# EAGLE schematic control project (EAGLE 9.6.2)
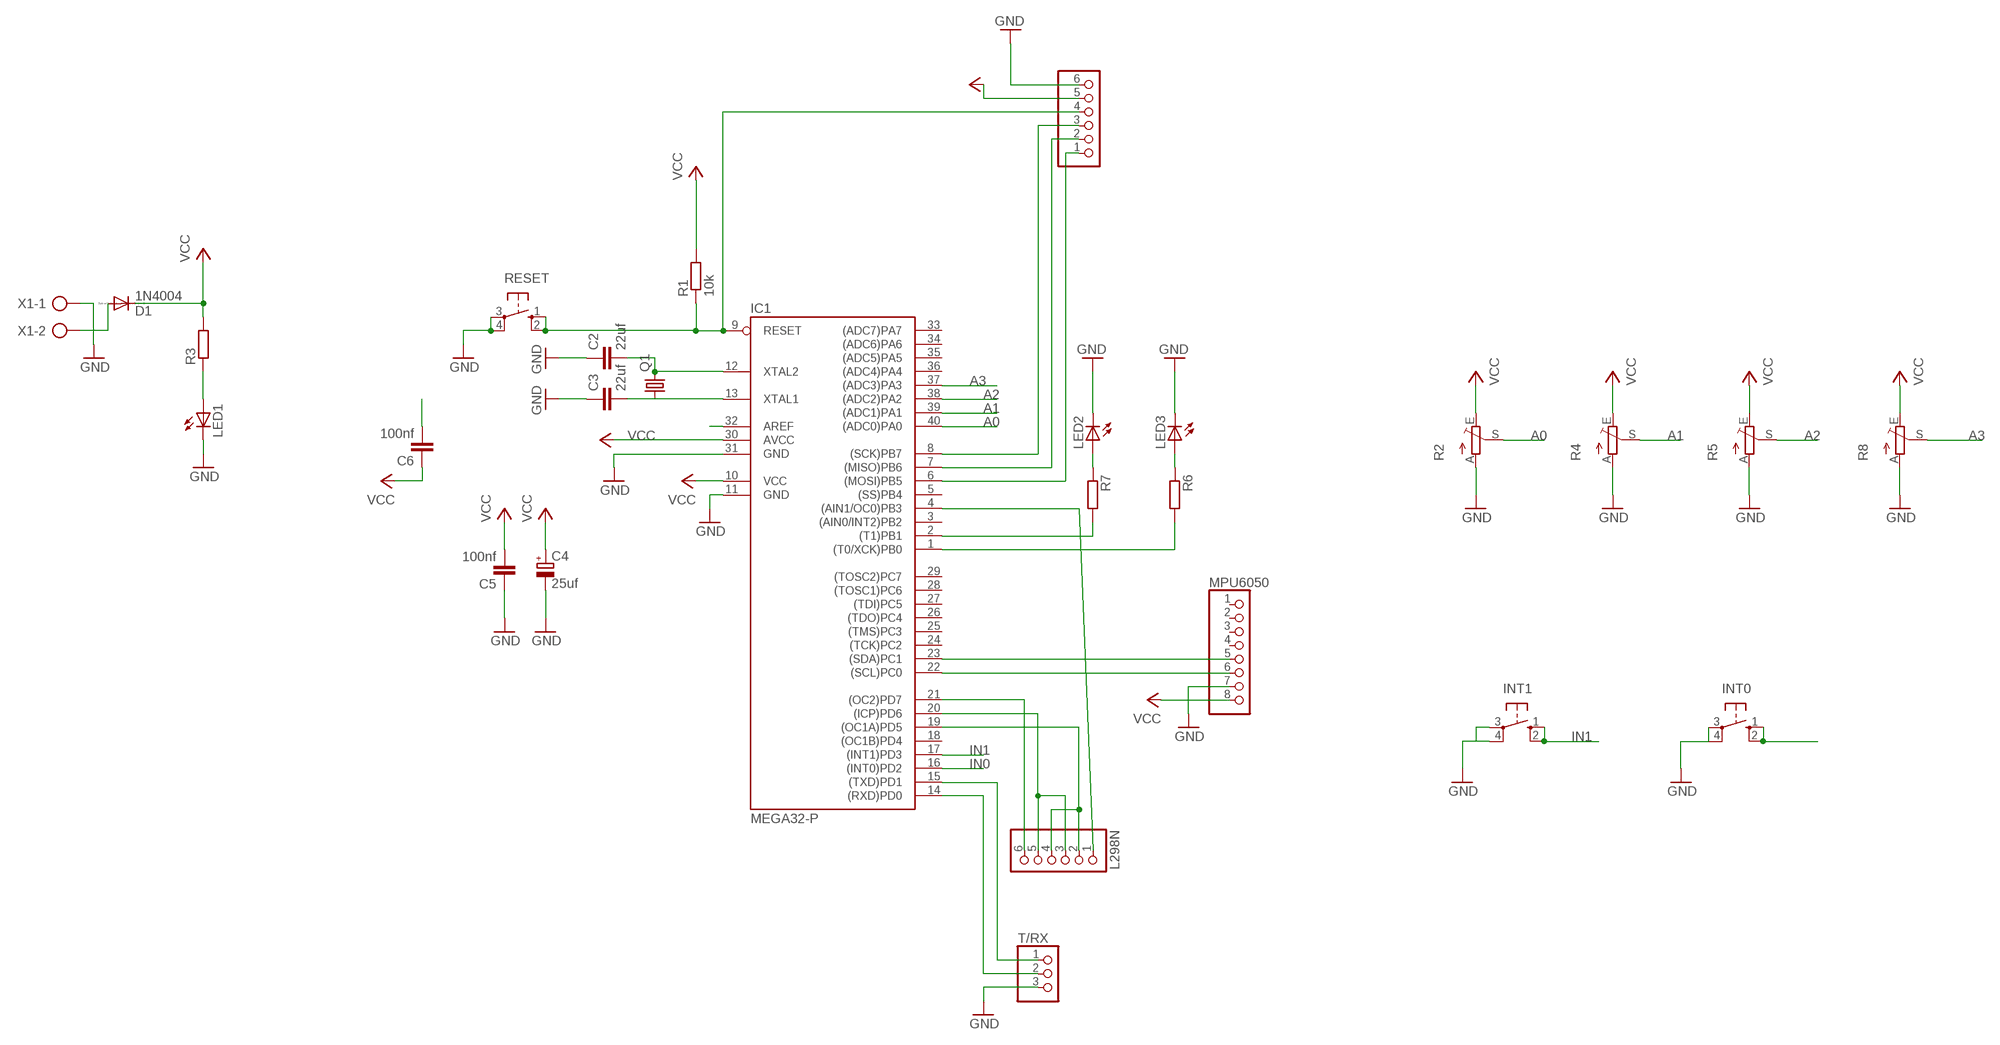
[diagram p0: schematic, sheet 1]

## Parts
C2  22uf  C-EU050-025X075  [C050-025X075]
C3  22uf  C-EU050-025X075  [C050-025X075]
C4  25uf  CPOL-EUE1.8-4  [E1,8-4]
C5  100nf  C-EU050-025X075  [C050-025X075]
C6  100nf  C-EU050-025X075  [C050-025X075]
D1  1N4004  [DO41-10]
IC1  MEGA32-P  [DIL40]
INT0  10-XX  [B3F-10XX]
INT1  10-XX  [B3F-10XX]
L298N  PINHD-1X6  [1X06]
LED1  LED5MM  [LED5MM]
LED2  LED5MM  [LED5MM]
LED3  LED5MM  [LED5MM]
MPU6050  PINHD-1X8  [1X08]
PROG  PINHD-1X6  [1X06]
Q1  CRYSTALHC49U-V  [HC49U-V]
R1  10k  R-EU_0207/7  [0207/7]
R2  TRIM_EU-RJ6  [RJ6]
R3  R-EU_0207/7  [0207/7]
R4  TRIM_EU-RJ6  [RJ6]
R5  TRIM_EU-RJ6  [RJ6]
R6  R-EU_0207/7  [0207/7]
R7  R-EU_0207/7  [0207/7]
R8  TRIM_EU-RJ6  [RJ6]
RESET  10-XX  [B3F-10XX]
T/RX  PINHD-1X3  [1X03]
X1  AK300/2  [AK300/2]

## Nets
A0: IC1.40((ADC0)PA0) R2.S
A1: IC1.39((ADC1)PA1) R4.S
A2: IC1.38((ADC2)PA2) R5.S
A3: IC1.37((ADC3)PA3) R8.S
AREF: C6.2 IC1.32(AREF)
GND: C2.1 C3.1 C4.- C5.1 IC1.11(GND) IC1.31(GND) INT0.3(P) INT0.4(P1) INT1.3(P) INT1.4(P1) LED1.K(C) LED2.K(C) LED3.K(C) MPU6050.7 PROG.6 R2.A R4.A R5.A R8.A RESET.3(P) RESET.4(P1) T/RX.3 X1.1
IN0: IC1.16((INT0)PD2) INT0.1(S) INT0.2(S1)
IN1: IC1.17((INT1)PD3) INT1.1(S) INT1.2(S1)
MISO: IC1.7((MISO)PB6) PROG.2
MOSI: IC1.6((MOSI)PB5) PROG.1
N$2: C2.2 IC1.12(XTAL2) Q1.2
N$3: C3.2 IC1.13(XTAL1) Q1.1
N$4: IC1.2((T1)PB1) R7.2
N$5: LED1.A R3.1
N$6: D1.A X1.2
N$7: IC1.1((T0/XCK)PB0) R6.2
N$8: LED3.A R6.1
N$9: LED2.A R7.1
N$12: IC1.19((OC1A)PD5) L298N.2 L298N.4
N$14: IC1.20((ICP)PD6) L298N.3 L298N.5
OC0: IC1.4((AIN1/OC0)PB3) L298N.1
OC2: IC1.21((OC2)PD7) L298N.6
RESET: IC1.9(RESET) PROG.4 R1.1 RESET.1(S) RESET.2(S1)
RX: IC1.14((RXD)PD0) T/RX.2
SCK: IC1.8((SCK)PB7) PROG.3
SCL: IC1.22((SCL)PC0) MPU6050.6
SDA: IC1.23((SDA)PC1) MPU6050.5
TX: IC1.15((TXD)PD1) T/RX.1
VCC: C4.+ C5.2 C6.1 D1.C IC1.10(VCC) IC1.30(AVCC) MPU6050.8 PROG.5 R1.2 R2.E R3.2 R4.E R5.E R8.E
Unconnected: IC1.3((AIN0/INT2)PB2) IC1.5((SS)PB4) IC1.18((OC1B)PD4) IC1.24((TCK)PC2) IC1.25((TMS)PC3) IC1.26((TDO)PC4) IC1.27((TDI)PC5) IC1.28((TOSC1)PC6) IC1.29((TOSC2)PC7) IC1.33((ADC7)PA7) IC1.34((ADC6)PA6) IC1.35((ADC5)PA5) IC1.36((ADC4)PA4) MPU6050.1 MPU6050.2 MPU6050.3 MPU6050.4

## Library data of the parts
C2 C3 C5 C6 = rcl:C-EU: CAPACITOR, European symbol
C4 = resistor:CPOL-EU: POLARIZED CAPACITOR, European symbol
D1 = diode:1N4004: DIODE general purpose rectifier, 1 A
IC1 = atmel:MEGA32-P: MICROCONTROLLER 32 Kbytes FLASH 2 Kbytes SRAM 1 Kbytes EEPROM USART 8-channel 10 bit ADC Source: www.atmel.com .. doc2503.pdf; MPN: ATMEGA32-16PU; OC_FARNELL: 1661729; OC_NEWARK: 51P1794
INT0 INT1 RESET = switch-omron:10-XX: OMRON SWITCH; MPN: B3F-1000; OC_FARNELL: 176432; OC_NEWARK: 36M3542
L298N PROG = pinhead:PINHD-1X6: PIN HEADER
LED1-LED3 = led:LED: LED OSRAM: - CHIPLED LG R971, LG N971, LY N971, LG Q971, LY Q971, LO R971, LY R971 LH N974, LH R974 LS Q976, LO Q976, LY Q976 LO Q996 - Hyper CHIPLED LW Q18S LB Q993, LB Q99A, LB R99A - SideLED LS A670, LO A670, LY A670, LG A670, LP A670 LB A673, LV A673, LT A673, LW A673 LH A674 LY A675 LS A676, LA A676, LO A676, LY A676, LW A676 LS A679, LY A679, LG A679 - Hyper Micro SIDELED® LS Y876, LA Y876, LO Y876, LY Y876 LT Y87S - SmartLED LW L88C, LW L88S LB L89C, LB L89S, LG L890 LS L89K, LO L89K, LY L89K LS L896, LA L896, LO L896, LY L896 - TOPLED LS T670, LO T670, LY T670, LG T670, LP T670 LSG T670, LSP T670, LSY T670, LOP T670, LYG T670 LG T671, LOG T671, LSG T671 LB T673, LV T673, LT T673, LW T673 LH T674 LS T676, LA T676, LO T676, LY T676, LB T676, LH T676, LSB T676, LW T676 LB T67C, LV T67C, LT T67C, LS T67K, LO T67K, LY T67K, LW E67C LS E67B, LA E67B, LO E67B, LY E67B, LB E67C, LV E67C, LT E67C LW T67C LS T679, LY T679, LG T679 LS T770, LO T770, LY T770, LG T770, LP T770 LB T773, LV T773, LT T773, LW T773 LH T774 LS E675, LA E675, LY E675, LS T675 LS T776, LA T776, LO T776, LY T776, LB T776 LHGB T686 LT T68C, LB T68C - Hyper Mini TOPLED® LB M676 - Mini TOPLED Santana® LG M470 LS M47K, LO M47K, LY M47K Source: http://www.osram.convergy.de LUXEON: - LUMILED® LXK2-PW12-R00, LXK2-PW12-S00, LXK2-PW14-U00, LXK2-PW14-V00 LXK2-PM12-R00, LXK2-PM12-S00, LXK2-PM14-U00 LXK2-PE12-Q00, LXK2-PE12-R00, LXK2-PE12-S00, LXK2-PE14-T00, LXK2-PE14-U00 LXK2-PB12-K00, LXK2-PB12-L00, LXK2-PB12-M00, LXK2-PB14-N00, LXK2-PB14-P00, LXK2-PB14-Q00 LXK2-PR12-L00, LXK2-PR12-M00, LXK2-PR14-Q00, LXK2-PR14-R00 LXK2-PD12-Q00, LXK2-PD12-R00, LXK2-PD12-S00 LXK2-PH12-R00, LXK2-PH12-S00 LXK2-PL12-P00, LXK2-PL12-Q00, LXK2-PL12-R00 Source: www.luxeon.com KINGBRIGHT: KA-3528ASYC Source: www.kingbright.com
MPU6050 = pinhead@1:PINHD-1X8: PIN HEADER
Q1 = crystal:CRYSTAL: CRYSTAL; OC_FARNELL: 1666969; OC_NEWARK: unknown
R1 R3 R6 R7 = rcl:R-EU_: RESISTOR, European symbol
R2 R4 R5 R8 = pot:TRIM_EU-: POTENTIOMETER
T/RX = pinhead:PINHD-1X3: PIN HEADER
X1 = con-ptr500:AK300/2: CONNECTOR; OC_FARNELL: unknown; OC_NEWARK: unknown